# EAGLE design VFD Board (EAGLE 9.1.3)
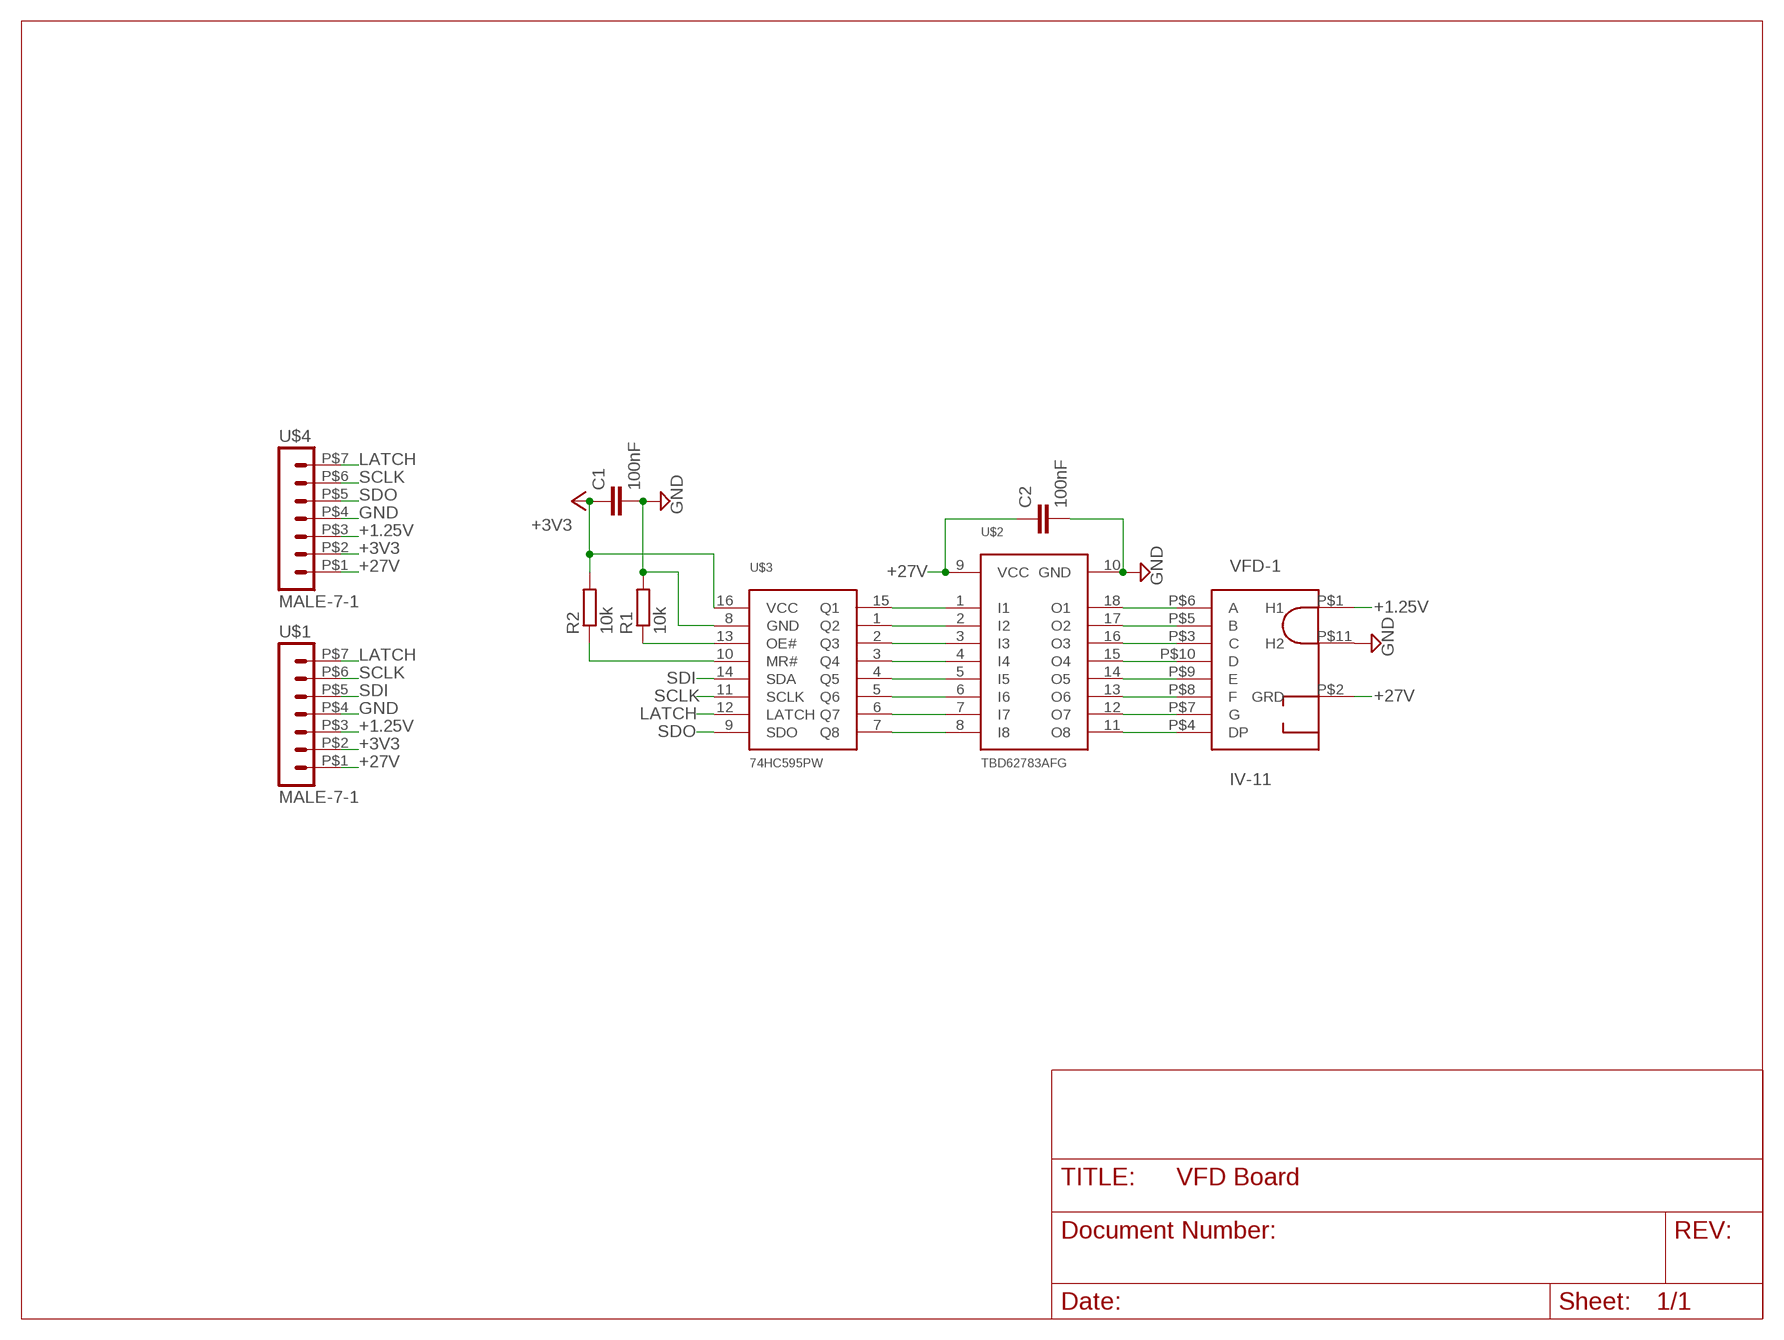
[diagram p0: schematic, sheet 1]

## Parts
C1  100nF  C-EUC0603  [C0603]
C2  100nF  C-EUC0603  [C0603]
R1  10k  R-EU_R0603  [R0603]
R2  10k  R-EU_R0603  [R0603]
U$1  MALE-7-1  [7-PIN-HEADER]
U$2  TBD62783AFG  [SOIC18L]
U$3  74HC595PW  [TSSOP16]
U$4  MALE-7-1  [7-PIN-HEADER]
VFD-1  IV-11  [IV-11]

## Nets
+1.25V: U$1.P$3 U$4.P$3 VFD-1.P$1(H1)
+3V3: C1.1 R2.2 U$1.P$2 U$3.16(VCC) U$4.P$2
+27V: C2.1 U$1.P$1 U$2.9(VCC) U$4.P$1 VFD-1.P$2(GRD)
GND: C1.2 C2.2 R1.2 U$1.P$4 U$2.10(GND) U$3.8(GND) U$4.P$4 VFD-1.P$11(H2)
LATCH: U$1.P$7 U$3.12(LATCH) U$4.P$7
N$1: U$2.1(I1) U$3.15(Q1)
N$2: U$2.2(I2) U$3.1(Q2)
N$3: U$2.3(I3) U$3.2(Q3)
N$4: U$2.4(I4) U$3.3(Q4)
N$5: U$2.5(I5) U$3.4(Q5)
N$6: U$2.6(I6) U$3.5(Q6)
N$7: U$2.7(I7) U$3.6(Q7)
N$8: U$2.8(I8) U$3.7(Q8)
N$9: U$2.18(O1) VFD-1.P$6(A)
N$10: U$2.17(O2) VFD-1.P$5(B)
N$11: U$2.16(O3) VFD-1.P$3(C)
N$12: U$2.15(O4) VFD-1.P$10(D)
N$13: U$2.14(O5) VFD-1.P$9(E)
N$14: U$2.13(O6) VFD-1.P$8(F)
N$15: U$2.12(O7) VFD-1.P$7(G)
N$16: U$2.11(O8) VFD-1.P$4(DP)
N$17: R1.1 U$3.13(OE#)
N$19: R2.1 U$3.10(MR#)
SCLK: U$1.P$6 U$3.11(SCLK) U$4.P$6
SDI: U$1.P$5 U$3.14(SDA)
SDO: U$3.9(SDO) U$4.P$5

## Library data of the parts
C1 C2 = rcl:C-EU: CAPACITOR, European symbol; SPICEPREFIX: C
R1 R2 = resistor:R-EU_: RESISTOR, European symbol
U$1 U$4 = VFD:MALE-7-1
U$2 = Mason-IC's:TBD62783AFG: 50v Source driver. High Input > 2v (works with 3v3)
U$3 = Mason-IC's:74HC595PW: 8 Bit parallel out shift register with latched data outputs. Nexperia part. TSSOP package
VFD-1 = Mason-Display:IV-11

## Board
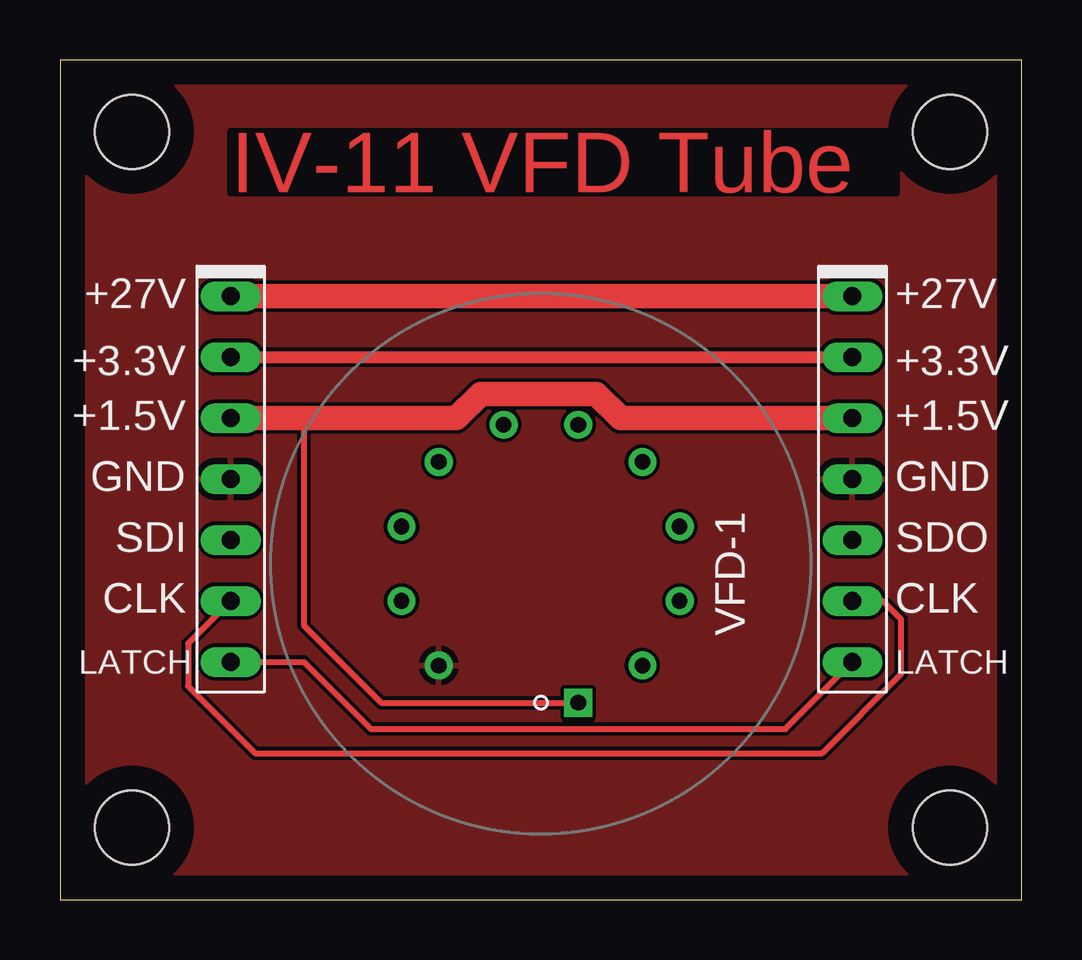
[diagram p1: board, top side]
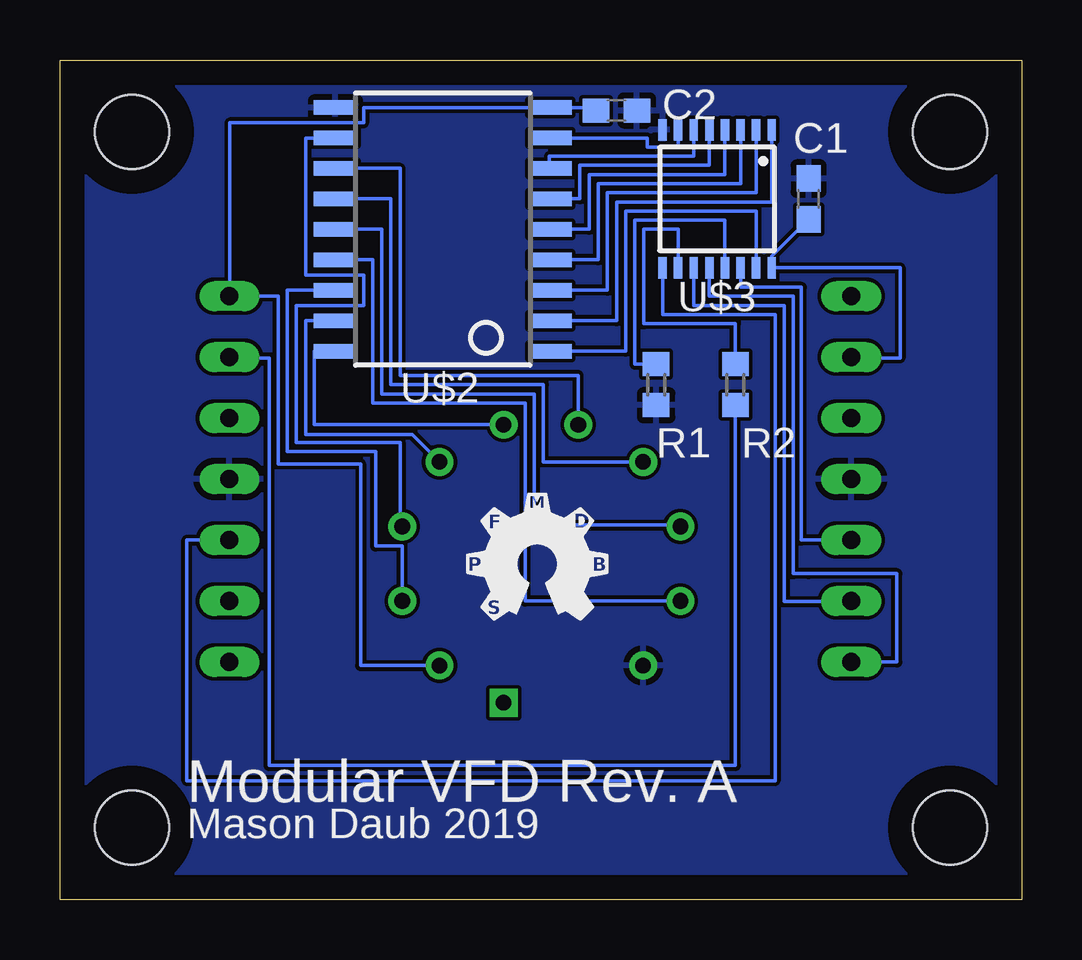
[diagram p2: board, bottom side, seen from below]

Size 40.08 x 35 mm. Coordinates in mm from the lower left corner, seen from the top.
Outline: 0,0 40.08,0 40.08,35 0,35 0,0
Copper layers (1*16): Top 0.035mm / dielectric 1.5mm / Bottom 0.035mm
Design rules "default": minimum track width 6mil, minimum drill 0.35mm, track to track 6mil, track to pad 6mil, pad to pad 6mil, via to via 6mil, smd to smd 6mil, copper to edge 40mil, drill to drill 6mil, minimum pad ring 10mil, minimum via ring 8mil, stop-mask expansion 4mil, vias tented up to drill 0mil, thermal gap 10mil
Holes 3.1 mm at 3,32 3,3 37.08,3 37.08,32

### Footprints (pad centres in the part's own frame; a part is rotated, then mirrored left to right if it is on the bottom)
C0603 = smd 1.1 x 1: 1 -0.85,0; 2 0.85,0
R0603 = smd 1 x 1.1: 1 -0.85,0; 2 0.85,0
7-PIN-HEADER = drill 0.75 long: P$1 0,7.62; P$2 0,5.08; P$3 0,2.54; P$4 0,0; P$5 0,-2.54; P$6 0,-5.08; P$7 0,-7.62
SOIC18L = smd 0.6 x 1.8: 1 -5.08,-4.475; 2 -3.81,-4.475; 3 -2.54,-4.475; 4 -1.27,-4.475; 5 0,-4.475; 6 1.27,-4.475; 7 2.54,-4.475; 8 3.81,-4.475; 9 5.08,-4.475; 10 5.08,4.475; 11 3.81,4.475; 12 2.54,4.475; 13 1.27,4.475; 14 0,4.475; 15 -1.27,4.475; 16 -2.54,4.475; 17 -3.81,4.475; 18 -5.08,4.475
TSSOP16 = smd 0.9 x 0.35: 1 -2.875,2.275; 2 -2.875,1.625; 3 -2.875,0.975; 4 -2.875,0.325; 5 -2.875,-0.325; 6 -2.875,-0.975; 7 -2.875,-1.625; 8 -2.875,-2.275; 9 2.875,-2.275; 10 2.875,-1.625; 11 2.875,-0.975; 12 2.875,-0.325; 13 2.875,0.325; 14 2.875,0.975; 15 2.875,1.625; 16 2.875,2.275
IV-11 = drill 0.65 square: P$1 1.553,-5.796 | drill 0.65: P$2 4.227,-4.242; P$3 5.78,-1.552; P$4 5.779,1.554; P$5 4.227,4.243; P$6 1.553,5.796; P$7 -1.553,5.796; P$8 -4.258,4.243; P$9 -5.811,1.554; P$10 -5.811,-1.552; P$11 -4.259,-4.242

### Placement (x,y rotation side)
C1  8.89,29.21 90 bottom
C2  16.89,32.89 0 bottom
R1  15.24,21.46 270 bottom
R2  11.94,21.46 270 bottom
U$1  7.11,17.53 0 top
U$2  24.13,27.94 90 bottom
U$3  12.7,29.21 270 bottom
U$4  33.02,17.53 0 top
VFD-1  20.04,14 0 top

### Tracks (layer width: path | path; a pad name or v marks a point on that pad's centre or on a via)
+1.25V
  Top 0.254: VFD-1.P$1 13.39,8.2 10.16,11.43 10.16,20.07 U$1.P$3
  Top 1.016: U$1.P$3 16.51,20.07 17.53,21.08 22.35,21.08 23.37,20.07 U$4.P$3
+3V3
  Top 0.508: U$1.P$2 U$4.P$2
  Bottom 0.152: C1.1 10.43,26.82 U$3.16 5.08,26.34 5.08,22.58 7.11,22.58 U$1.P$2 | R2.2 11.94,5.59 31.37,5.59 31.37,22.58 32.99,22.58 U$4.P$2
+27V
  Top 1.016: U$1.P$1 U$4.P$1
  Bottom 0.152: C2.1 17.74,33.02 U$2.9 27.43,33.02 27.43,32.38 33,32.38 33,25.15 | VFD-1.P$2 27.56,9.76 27.56,18.16 30.99,18.16 30.99,25.15 33,25.15 | U$4.P$1 33,25.15
GND
  pour Bottom: -1.27,35.56 -1.27,-1.27 39.88,-1.27 39.88,35.56
  pour Top: -1.27,35.56 -1.27,-1.27 44.45,-1.27 44.45,35.56
LATCH
  Top 0.254: U$1.P$7 10.16,9.91 12.95,7.11 30.23,7.11 U$4.P$7
  Bottom 0.152: U$3.12 13.03,25.15 9.53,25.15 9.53,13.59 8.89,13.59 5.21,13.59 5.21,9.91 U$1.P$7
N$1
  Bottom 0.152: U$3.15 11.07,28.7 16.51,28.7 16.51,22.86 U$2.1
N$2
  Bottom 0.152: U$3.1 10.43,29.08 16.89,29.08 16.89,24.13 U$2.2
N$3
  Bottom 0.152: U$3.2 11.07,29.46 17.27,29.46 17.27,25.4 U$2.3
N$4
  Bottom 0.152: U$3.3 11.72,29.84 17.65,29.84 17.65,26.67 U$2.4
N$5
  Bottom 0.152: U$3.4 12.38,30.23 18.03,30.23 18.03,27.94 U$2.5
N$6
  Bottom 0.152: U$3.5 13.03,30.61 18.41,30.61 18.41,29.21 U$2.6
N$7
  Bottom 0.152: U$3.6 13.68,30.99 19.68,30.99 19.68,30.51 U$2.7
N$8
  Bottom 0.152: U$3.7 14.32,31.37 15.62,31.37 15.62,31.75 U$2.8
N$9
  Bottom 0.152: VFD-1.P$6 29.49,19.8 29.49,22.86 U$2.18
N$10
  Bottom 0.152: U$2.17 29.84,24.13 29.84,19.39 25.41,19.39 VFD-1.P$5
N$11
  Bottom 0.152: VFD-1.P$3 25.82,14.73 26.92,14.73 26.92,18.67 30.61,18.67 30.61,25.4 U$2.16
N$12
  Bottom 0.152: VFD-1.P$10 20.7,12.45 20.7,20.7 27.05,20.7 27.05,26.67 U$2.15
N$13
  Bottom 0.152: VFD-1.P$9 14.23,15.62 20.32,15.62 20.32,21.08 26.67,21.08 26.67,27.94 U$2.14
N$14
  Bottom 0.152: VFD-1.P$8 19.94,18.24 19.94,21.46 26.29,21.46 26.29,29.21 U$2.13
N$15
  Bottom 0.152: VFD-1.P$7 18.49,21.84 25.91,21.84 25.91,30.48 U$2.12
N$16
  Bottom 0.152: U$2.11 29.84,31.75 29.84,26.04 27.43,26.04 27.43,24.77 30.23,24.77 30.23,19.05 25.91,19.05 25.91,15.55 VFD-1.P$4
N$17
  Bottom 0.152: U$3.13 12.38,28.32 16.13,28.32 16.13,24.13 16.13,22.31 R1.1
N$19
  Bottom 0.152: U$3.10 14.32,27.94 15.75,27.94 15.75,24.13 15.75,24 11.94,24 R2.1
SCLK
  Top 0.254: U$1.P$6 5.33,10.67 5.33,8.89 8.13,6.1 31.75,6.1 35.05,9.4 35.05,11.68 34.29,12.45 U$4.P$6
  Bottom 0.152: U$3.11 13.68,24.77 9.91,24.77 9.91,12.42 7.14,12.42 U$1.P$6
SDI
  Bottom 0.152: U$3.14 11.72,25.53 9.19,25.53 9.19,14.99 U$1.P$5
SDO
  Bottom 0.152: U$3.9 14.97,24.38 10.29,24.38 10.29,4.95 34.8,4.95 34.8,14.99 U$4.P$5

### Text on the board
Top: IV-11 VFD Tube
tPlace: +27V | +27V | +3.3V | +3.3V | +1.5V | +1.5V | GND | GND | SDI | SDO | CLK | CLK | LATCH | LATCH
bPlace: Modular VFD Rev. A | Mason Daub 2019
tStop: IV-11 VFD Tube